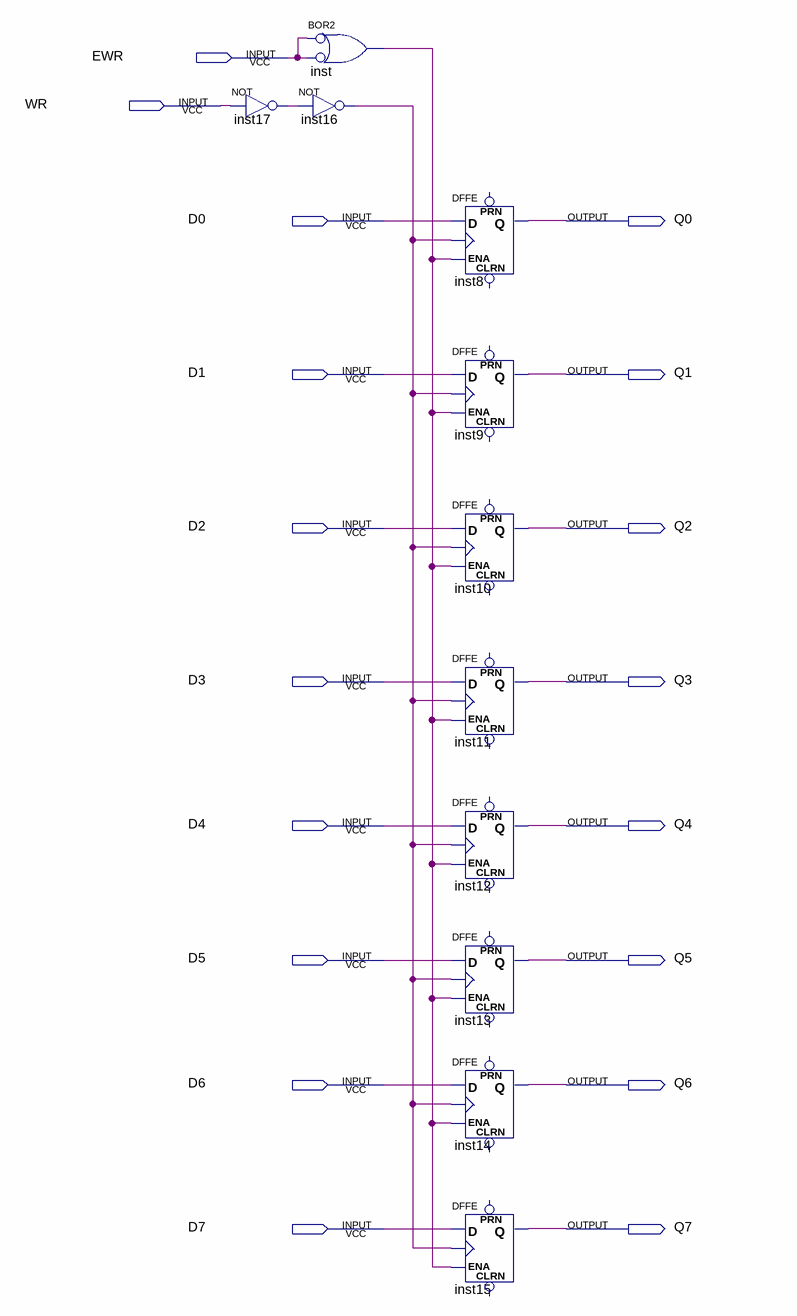
[diagram p0: schematic sheet]
// Quartus schematic kp1533ir35.bdf as structural Verilog: 11 symbols, 18 pins
module kp1533ir35 (
  input  EWR,
  input  WR,
  input  D0,
  input  D1,
  input  D2,
  input  D3,
  input  D4,
  input  D5,
  input  D6,
  input  D7,
  output Q0,
  output Q1,
  output Q2,
  output Q3,
  output Q4,
  output Q5,
  output Q6,
  output Q7
);

  wire inst16_out, inst17_out, inst_out;

  not inst17 (inst17_out, WR);
  or inst (inst_out, ~EWR, ~EWR);  // BOR2
  not inst16 (inst16_out, inst17_out);
  DFFE inst8 (.D(D0), .CLK(inst16_out), .ENA(inst_out), .Q(Q0));  // open: PRN, CLRN
  DFFE inst9 (.D(D1), .CLK(inst16_out), .ENA(inst_out), .Q(Q1));  // open: PRN, CLRN
  DFFE inst10 (.D(D2), .CLK(inst16_out), .ENA(inst_out), .Q(Q2));  // open: PRN, CLRN
  DFFE inst11 (.D(D3), .CLK(inst16_out), .ENA(inst_out), .Q(Q3));  // open: PRN, CLRN
  DFFE inst12 (.D(D4), .CLK(inst16_out), .ENA(inst_out), .Q(Q4));  // open: PRN, CLRN
  DFFE inst13 (.D(D5), .CLK(inst16_out), .ENA(inst_out), .Q(Q5));  // open: PRN, CLRN
  DFFE inst14 (.D(D6), .CLK(inst16_out), .ENA(inst_out), .Q(Q6));  // open: PRN, CLRN
  DFFE inst15 (.D(D7), .CLK(inst16_out), .ENA(inst_out), .Q(Q7));  // open: PRN, CLRN
endmodule
